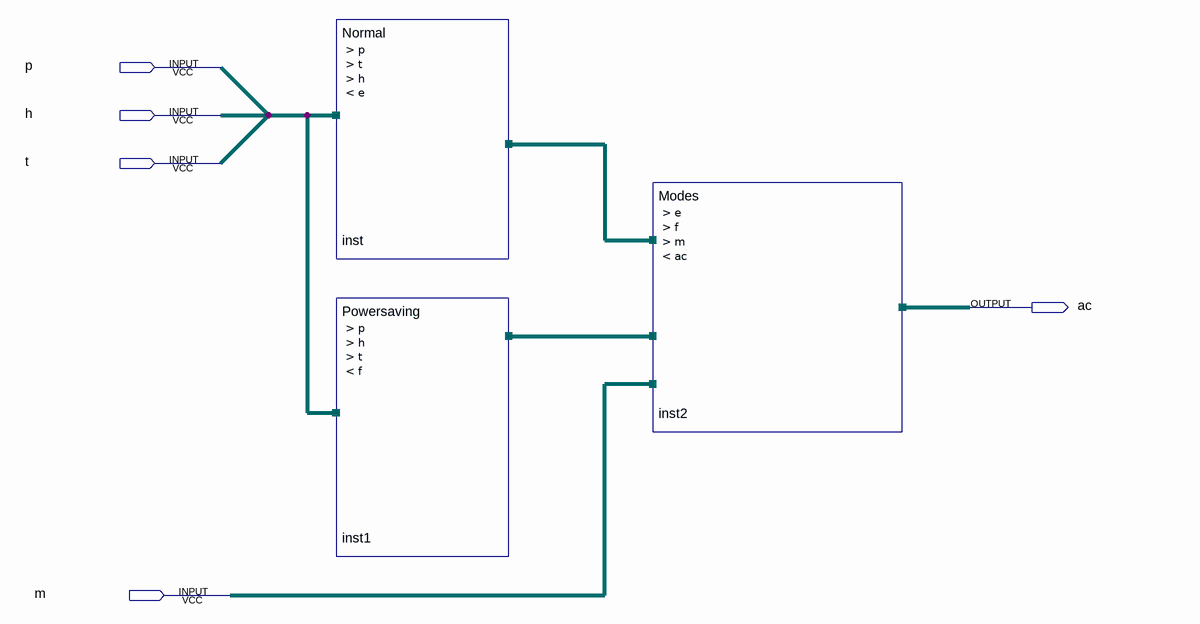
[diagram p0: schematic sheet]
// Quartus schematic diagram.bdf as structural Verilog: 3 symbols, 5 pins
module diagram (
  input  p,
  input  h,
  input  t,
  input  m,
  output ac
);

  wire e, f;

  Normal inst (.p(p), .t(t), .h(h), .e(e));
  Powersaving inst1 (.p(p), .h(h), .t(t), .f(f));
  Modes inst2 (.e(e), .f(f), .m(m), .ac(ac));
endmodule
